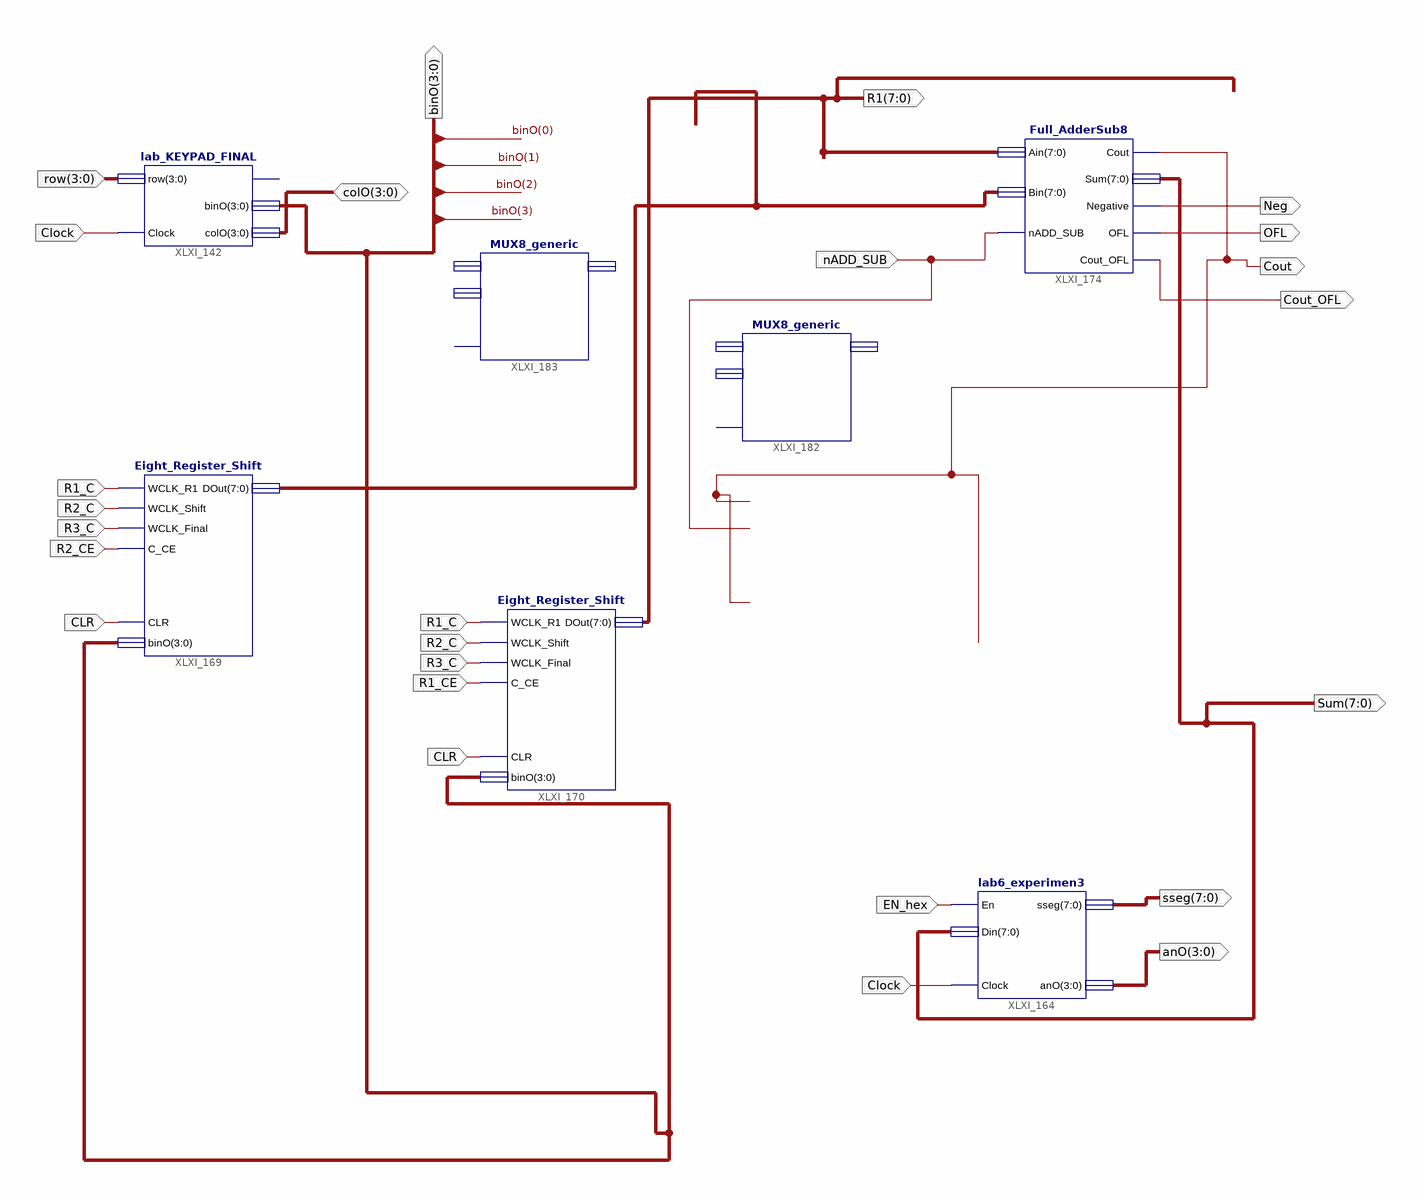
[diagram p0: schematic sheet 1]
// Xilinx ISE schematic test_FullAdder.sch (spartan3e) as structural Verilog: 7 symbols, 20 ports
module test_FullAdder (
  input  [3:0] row,
  input  Clock,
  input  R1_C,
  input  R2_C,
  input  R3_C,
  input  CLR,
  input  R2_CE,
  input  R1_CE,
  input  nADD_SUB,
  input  EN_hex,
  inout  [3:0] colO,
  output [3:0] binO,
  output [7:0] R1,
  output Cout,
  output [7:0] sseg,
  output [3:0] anO,
  output [7:0] Sum,
  output Neg,
  output OFL,
  output Cout_OFL
);

  wire [7:0] XLXN_165;

  lab_KEYPAD_FINAL XLXI_142 (.Clock(Clock), .row(row), .colO(colO), .binO(binO));  // open: keyO
  Eight_Register_Shift XLXI_169 (
    .WCLK_Shift(R2_C), .C_CE(R2_CE), .WCLK_R1(R1_C), .CLR(CLR), .WCLK_Final(R3_C), .DOut(XLXN_165),
    .binO(binO));
  Eight_Register_Shift XLXI_170 (
    .WCLK_Shift(R2_C), .C_CE(R1_CE), .WCLK_R1(R1_C), .CLR(CLR), .WCLK_Final(R3_C), .DOut(R1), .binO(binO));
  MUX8_generic XLXI_182 ();  // open: D_In, I_In, DOut, nIM_Din
  MUX8_generic XLXI_183 ();  // open: D_In, I_In, DOut, nIM_Din
  lab6_experimen3 XLXI_164 (.En(EN_hex), .Din(Sum), .Clock(Clock), .sseg(sseg), .anO(anO));
  Full_AdderSub8 XLXI_174 (
    .Ain(R1), .Bin(XLXN_165), .nADD_SUB(nADD_SUB), .Cout(Cout), .Sum(Sum), .Negative(Neg), .OFL(OFL),
    .Cout_OFL(Cout_OFL));
endmodule
